# Altium schematic sheet Measurements.SchDoc: Measurement circuits
size A3; Author: Kajetan Śpionek
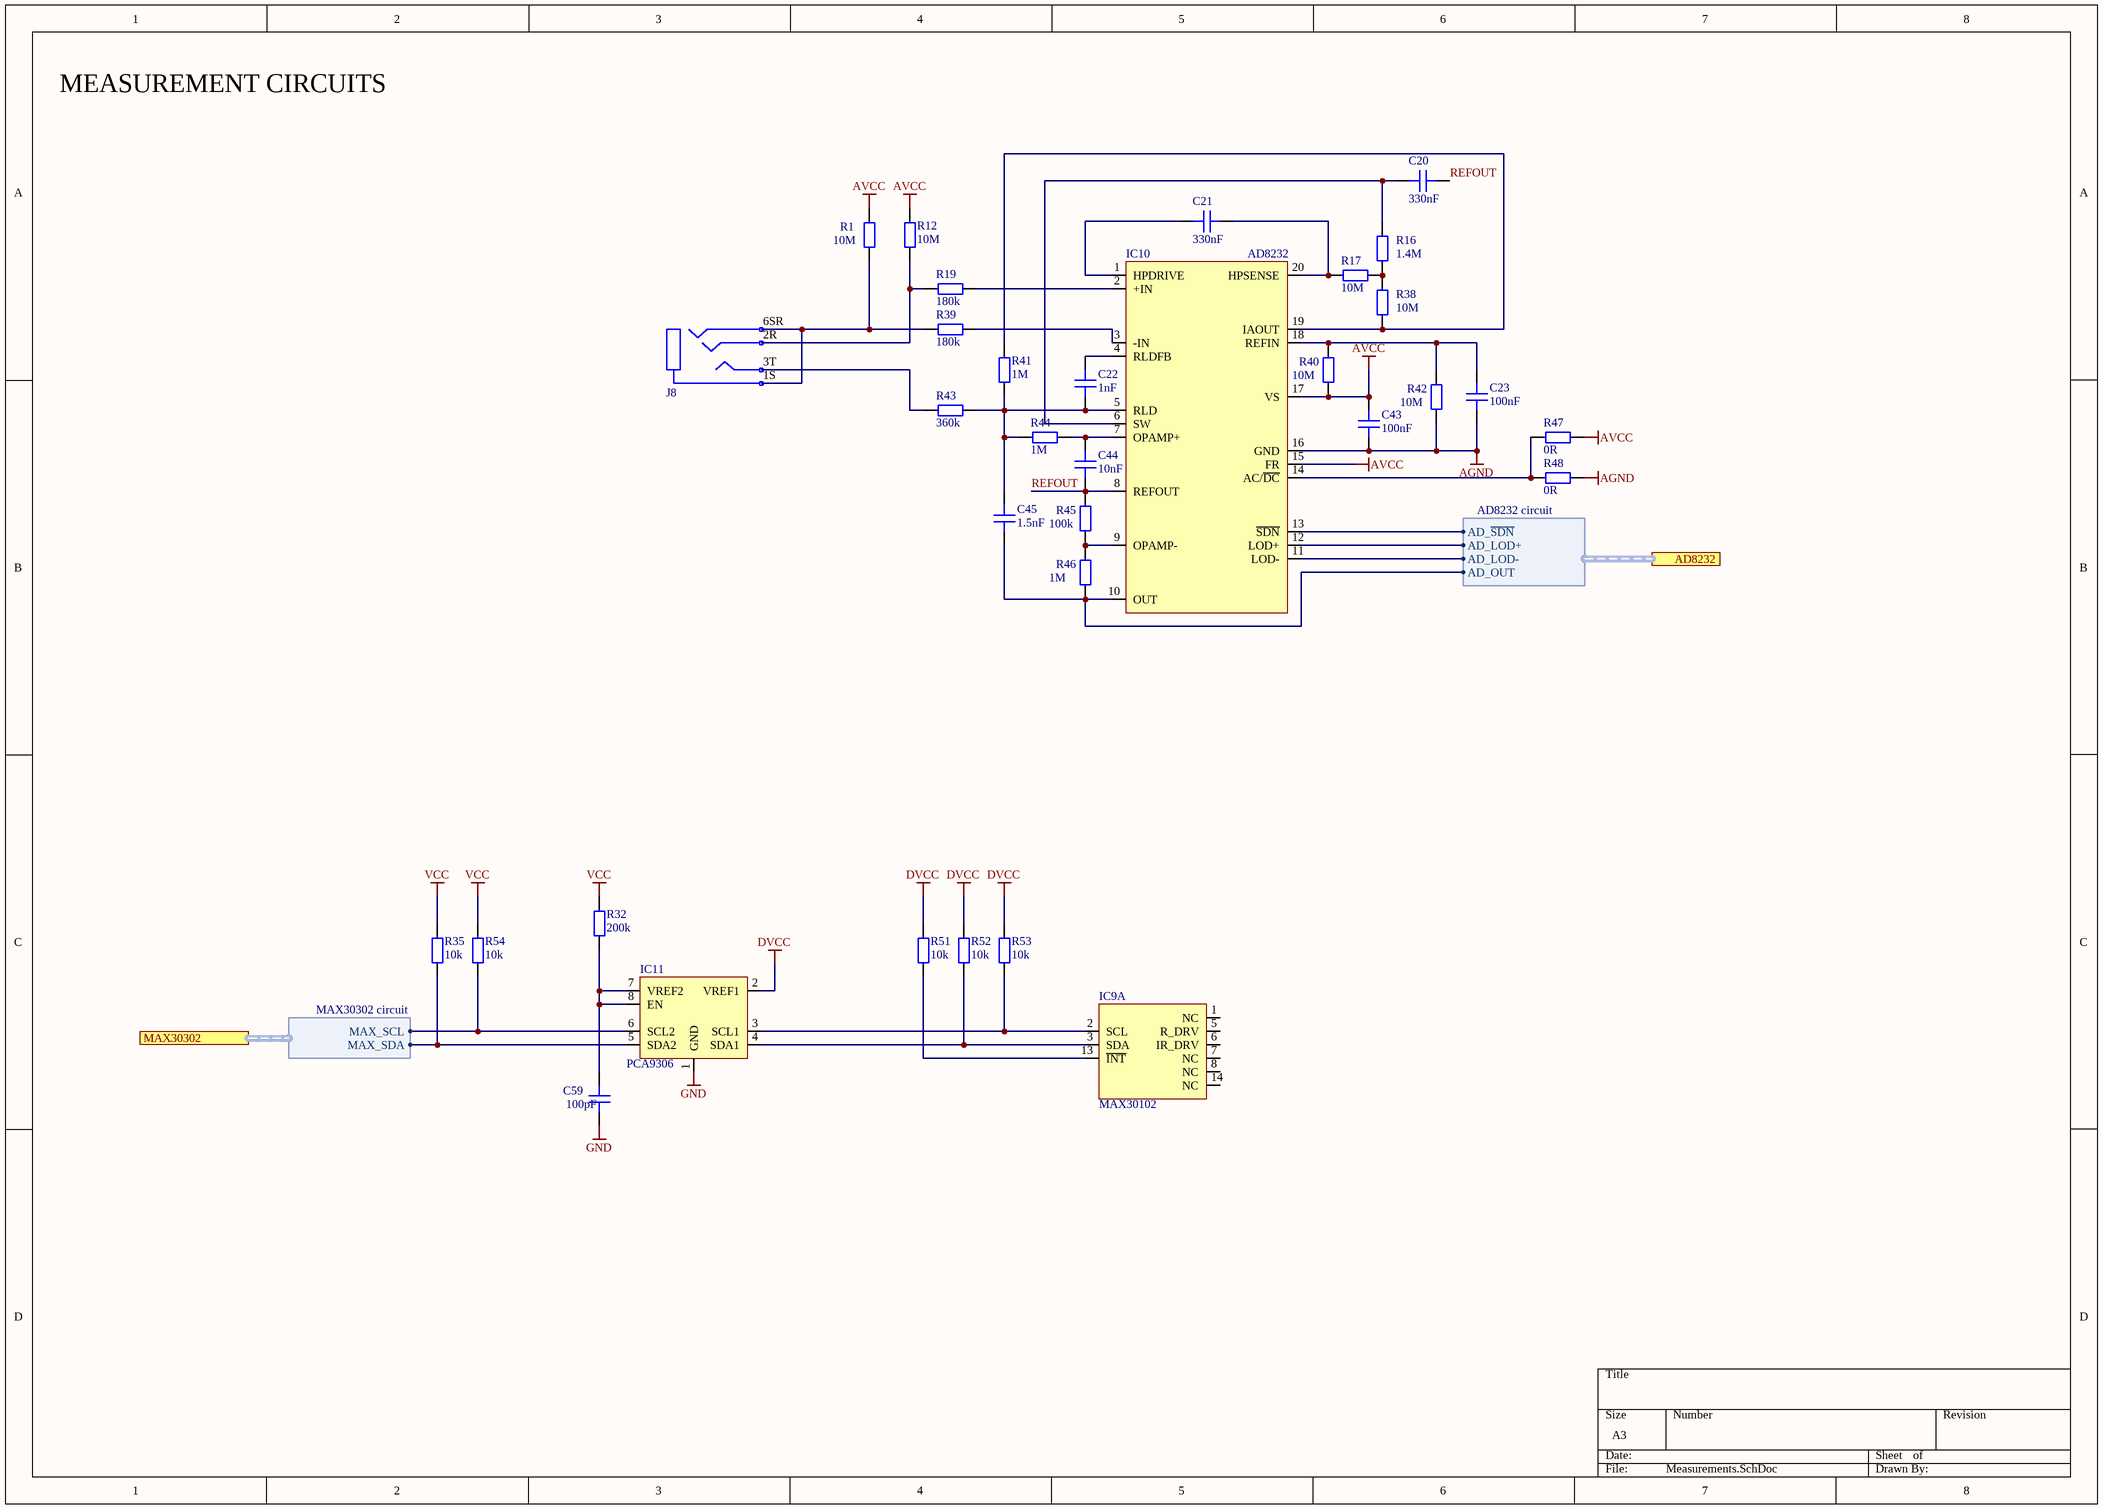
[diagram p0: Measurements.SchDoc]

## Parts
C20  330nF  [CAP 0603]
C21  330nF  [CAP 0603]
C22  1nF  [CAP 0603]
C23  100nF  [CAP 0603]
C43  100nF  [CAP 0603]
C44  10nF  [CAP 0603]
C45  1.5nF  [CAP 0603]
C59  100pF  [CAP 0603]
IC9  MAX30102  [MAX30102]  (part A of 2)
IC10  AD8232  [LFCSP 20]
IC11  PCA9306  [SSOP8]
J8  4 pin  [CLIFF FC68126]  (value not drawn)
R1  10M  [RES 0603]
R12  10M  [RES 0603]
R16  1.4M  [RES 0603]
R17  10M  [RES 0603]
R19  180k  [RES 0603]
R32  200k  [RES 0603]
R35  10k  [RES 0603]
R38  10M  [RES 0603]
R39  180k  [RES 0603]
R40  10M  [RES 0603]
R41  1M  [RES 0603]
R42  10M  [RES 0603]
R43  360k  [RES 0603]
R44  1M  [RES 0603]
R45  100k  [RES 0603]
R46  1M  [RES 0603]
R47  0R  [RES 0603]
R48  0R  [RES 0603]
R51  10k  [RES 0603]
R52  10k  [RES 0603]
R53  10k  [RES 0603]
R54  10k  [RES 0603]

## Ports
AD8232 (harness AD8232 circuit), MAX30302 (harness MAX30302 circuit)

## Harnesses
MAX30302 circuit: MAX_SCL, MAX_SDA
AD8232 circuit: AD_~{SDN}, AD_LOD+, AD_LOD-, AD_OUT

## Nets
AGND: C23.1 C43.1 IC10.16(GND) R42.1 R48.1
AVCC: C43.2 IC10.15(FR) IC10.17(VS) R1.2 R12.1 R40.1 R47.2
DVCC: IC11.2(VREF1) R51.2 R52.2 R53.2
GND: C59.1 IC11.1(GND)
VCC: R32.2 R35.2 R54.2
REFOUT: C20.1 C44.1 IC10.8(REFOUT) R45.2
NetC20_2: C20.2 IC10.6(SW) R16.2
NetC21_1: C21.1 IC10.20(HPSENSE) R17.2
NetC21_2: C21.2 IC10.1(HPDRIVE)
NetC22_1: C22.1 C45.2 IC10.5(RLD) R41.2 R43.1 R44.2
NetC22_2: C22.2 IC10.4(RLDFB)
NetC23_2: C23.2 IC10.18(REFIN) R40.2 R42.2
NetC44_2: C44.2 IC10.7(OPAMP+) R44.1
NetC45_1: C45.1 IC10.10(OUT) R46.1 ; port AD8232.AD_OUT
NetC59_2: C59.2 IC11.7(VREF2) IC11.8(EN) R32.1
NetIC9_2: IC9.2(SCL) IC11.3(SCL1) R53.1
NetIC9_3: IC9.3(SDA) IC11.4(SDA1) R52.1
NetIC9_13: IC9.13(~{INT}) R51.1
NetIC10_2: IC10.2(+IN) R19.1
NetIC10_3: IC10.3(-IN) R39.1
NetIC10_9: IC10.9(OPAMP-) R45.1 R46.2
NetIC10_11: IC10.11(LOD-) ; port AD8232.AD_LOD-
NetIC10_12: IC10.12(LOD+) ; port AD8232.AD_LOD+
NetIC10_13: IC10.13(~{SDN}) ; port AD8232.AD_~{SDN}
NetIC10_14: IC10.14(AC/~{DC}) R47.1 R48.2
NetIC10_19: IC10.19(IAOUT) R38.1 R41.1
NetIC11_5: IC11.5(SDA2) R35.1 ; port MAX30302.MAX_SDA
NetIC11_6: IC11.6(SCL2) R54.1 ; port MAX30302.MAX_SCL
NetJ8_1S: J8.1S J8.6SR R1.1 R39.2
NetJ8_2R: J8.2R R12.2 R19.2
NetJ8_3T: J8.3T R43.2
NetR16_1: R16.1 R17.1 R38.2

Not connected (* = marked no-connect by the designer): IC9 1(NC) 5(R_DRV) 6(IR_DRV) 7(NC) 8(NC) 14(NC)

## Notes on the sheet
- MEASUREMENT CIRCUITS

## Library data of the parts
C20-C23 C43-C45 C59 = Capacitor: SMT Capacitor
  C20 C21: Value: 330nF
  C22: Value: 1nF
  C23 C43: Value: 100nF
  C44: Value: 10nF
  C45: Value: 1.5nF
  C59: Value: 100pF
IC9 = MAX30102: Pulse Oximeter and Heart-Rate Sensor
IC10 = AD8232: Single-Lead, Heart Rate Monitor Front End
IC11 = PCA9306: Dual Bidirectional I2C Bus and SMBus Voltage-Level Translator
J8 = CLIFF FC68127 3.5mm: Jack 3,5mm, dock, female
R1 R12 R16 R17 R19 R32 R35 R38-R48 R51-R54 = Resistor: SMDResistor
  R1 R12 R17 R38 R40 R42: Value: 10M
  R16: Value: 1.4M
  R19 R39: Value: 180k
  R32: Value: 200k
  R35 R51-R54: Value: 10k
  R41 R44 R46: Value: 1M
  R43: Value: 360k
  R45: Value: 100k
  R47 R48: Value: 0R